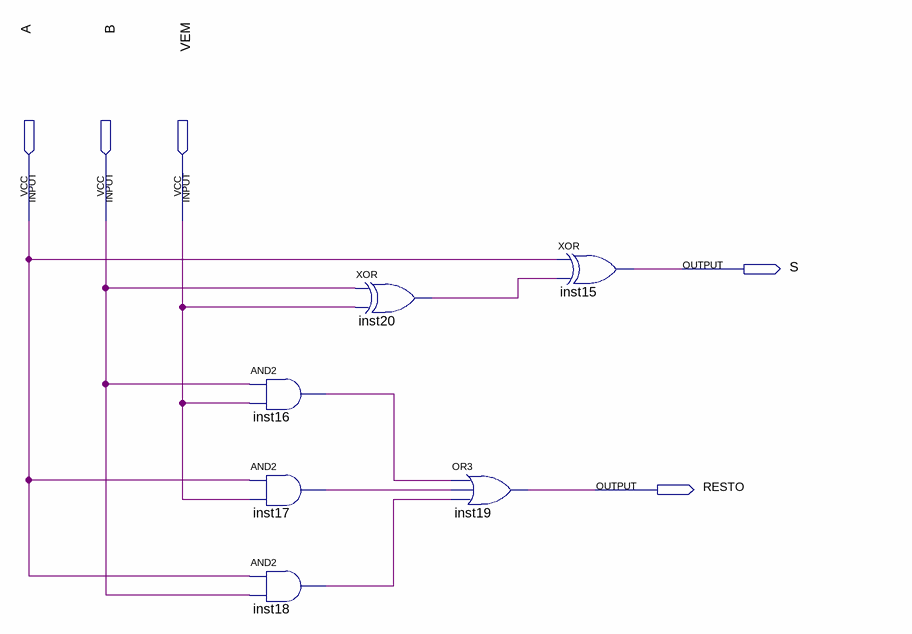
[diagram p0: schematic sheet]
// Quartus schematic somador_completo.bdf as structural Verilog: 6 symbols, 5 pins
module somador_completo (
  input  A,
  input  B,
  input  VEM,
  output S,
  output RESTO
);

  wire inst16_out, inst17_out, inst18_out, inst20_out;

  and inst16 (inst16_out, B, VEM);
  and inst17 (inst17_out, A, VEM);
  and inst18 (inst18_out, A, B);
  xor inst20 (inst20_out, B, VEM);
  or inst19 (RESTO, inst16_out, inst17_out, inst18_out);
  xor inst15 (S, A, inst20_out);
endmodule
